# EAGLE schematic MCU board ATmega328p v2.4 (EAGLE 9.2.1)
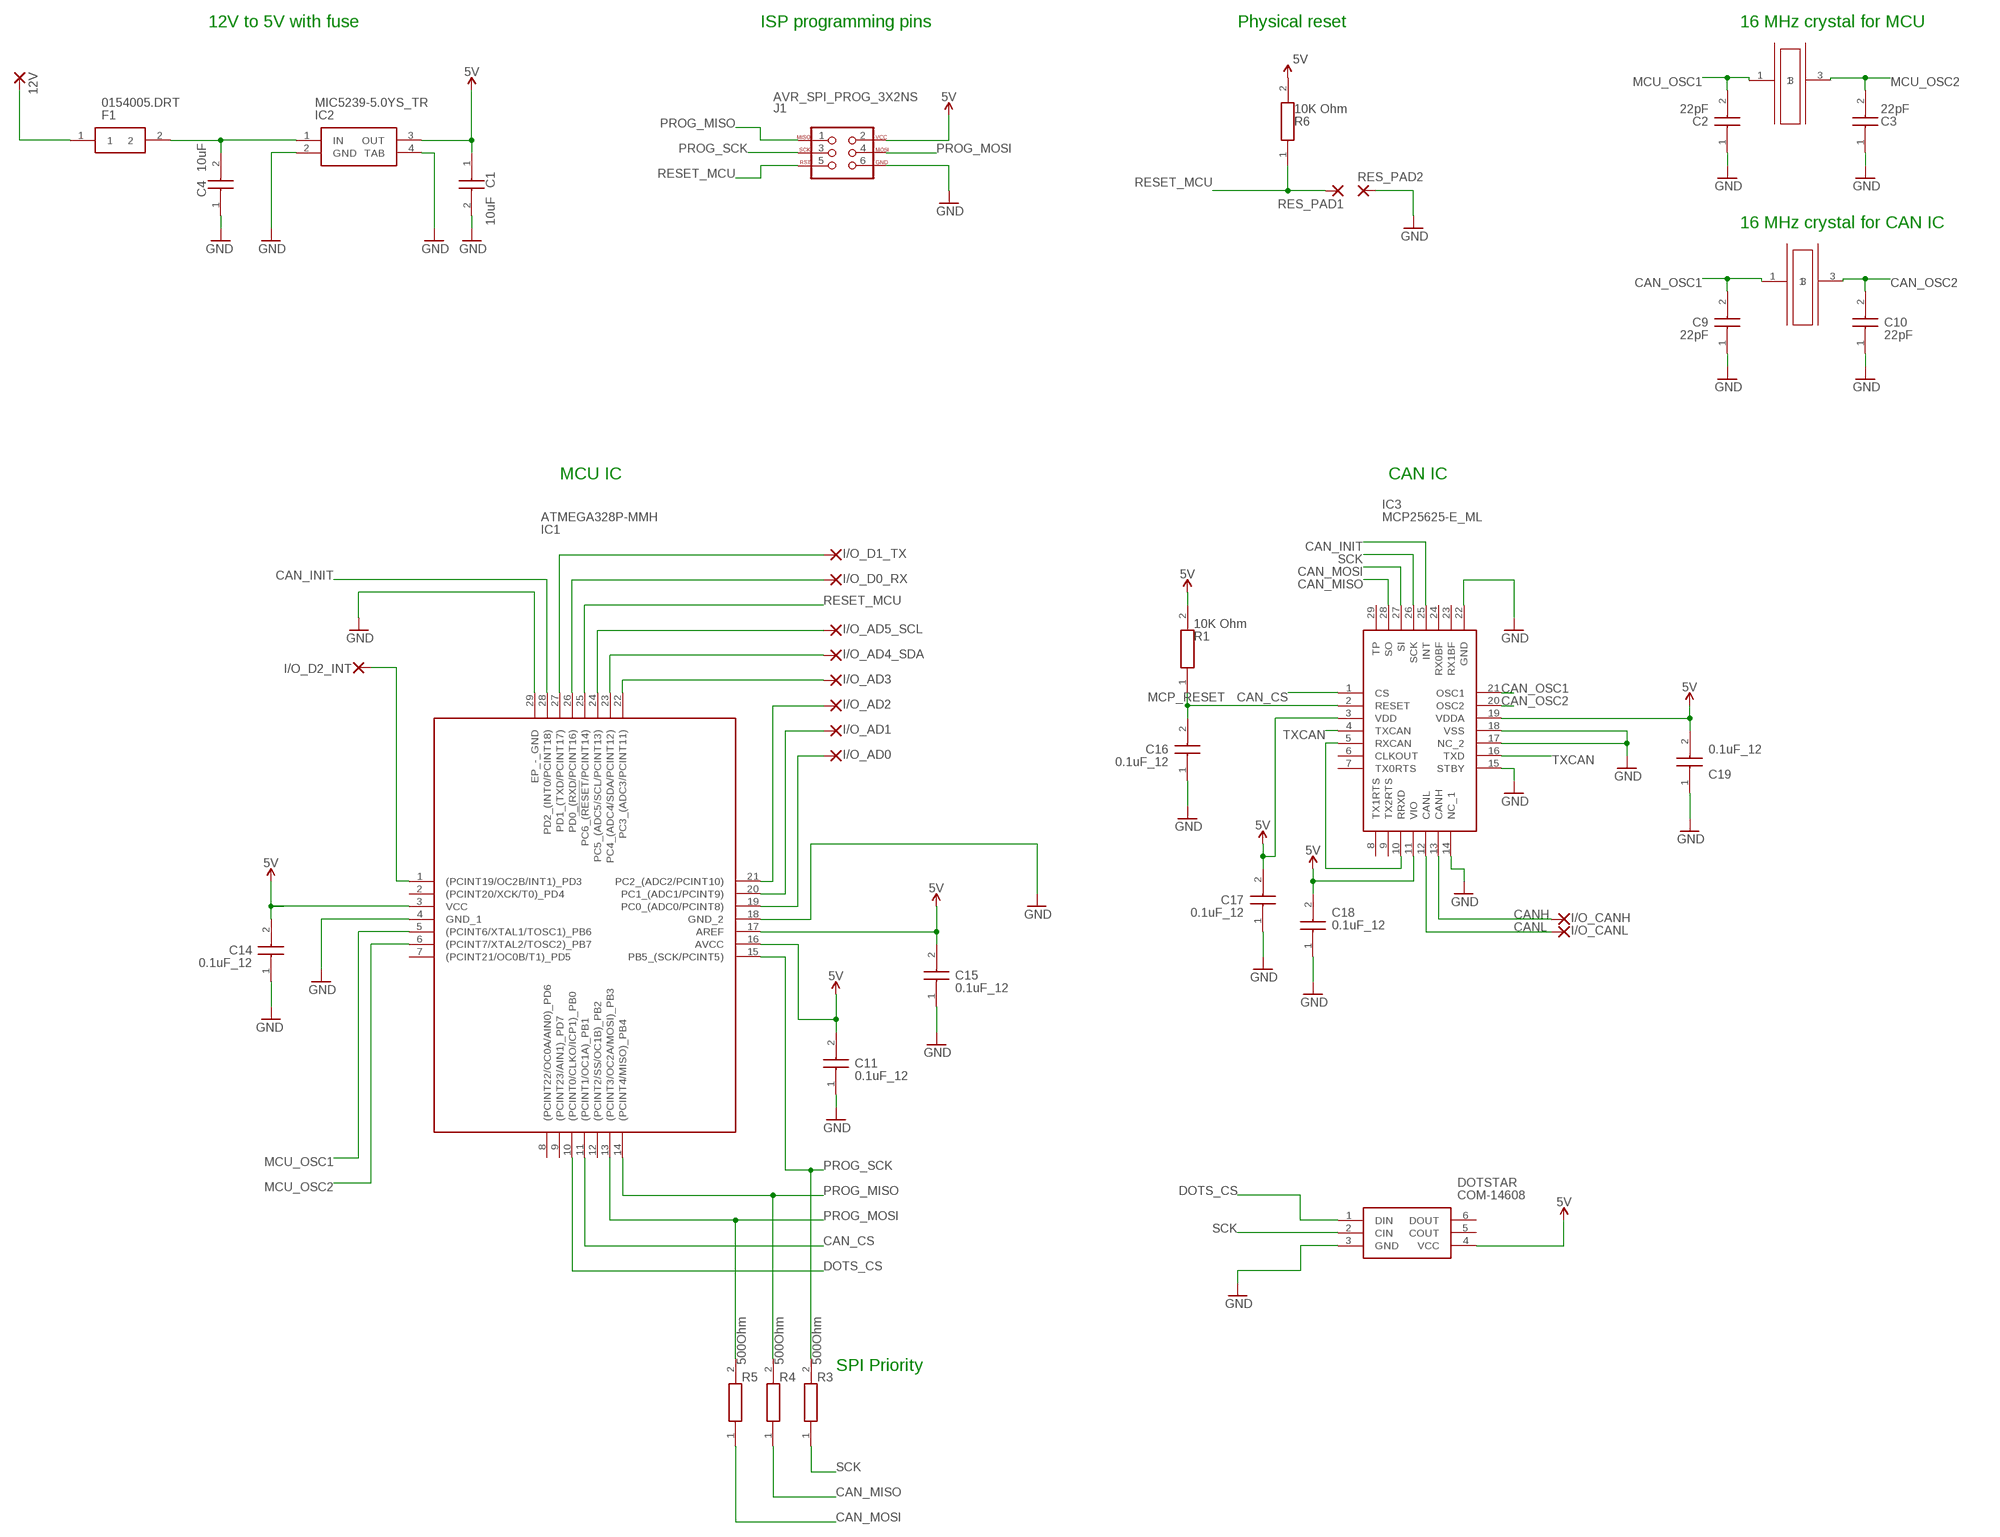
[diagram p0: schematic, sheet 1]

## Parts
12V  2,15/1,0(HALFHOLE)H+V  [2,54/2,0(HALFHOLE)H+V]
C1  10uF  T491A106K016AT  [CAPPM3216X180N]
C2  22pF  12066D106KAT2A  [CAPC3216X229N]
C3  22pF  12066D106KAT2A  [CAPC3216X229N]
C4  10uF  T491A106K016AT  [CAPPM3216X180N]
C9  22pF  12066D106KAT2A  [CAPC3216X229N]
C10  22pF  12066D106KAT2A  [CAPC3216X229N]
C11  0.1uF_12  12066D106KAT2A  [CAPC3216X229N]
C14  0.1uF_12  12066D106KAT2A  [CAPC3216X229N]
C15  0.1uF_12  12066D106KAT2A  [CAPC3216X229N]
C16  0.1uF_12  12066D106KAT2A  [CAPC3216X229N]
C17  0.1uF_12  12066D106KAT2A  [CAPC3216X229N]
C18  0.1uF_12  12066D106KAT2A  [CAPC3216X229N]
C19  0.1uF_12  12066D106KAT2A  [CAPC3216X229N]
DOTSTAR  COM-14608  [SON75P200X200X100-6N]
F1  0154005.DRT  [0154001.DRT]
I/O_AD0  2,15/1,0(HALFHOLE)H+V  [2,54/2,0(HALFHOLE)H+V]
I/O_AD1  2,15/1,0(HALFHOLE)H+V  [2,54/2,0(HALFHOLE)H+V]
I/O_AD2  2,15/1,0(HALFHOLE)H+V  [2,54/2,0(HALFHOLE)H+V]
I/O_AD3  2,15/1,0(HALFHOLE)H+V  [2,54/2,0(HALFHOLE)H+V]
I/O_AD4_SDA  2,15/1,0(HALFHOLE)H+V  [2,54/2,0(HALFHOLE)H+V]
I/O_AD5_SCL  2,15/1,0(HALFHOLE)H+V  [2,54/2,0(HALFHOLE)H+V]
I/O_CANH  2,15/1,0(HALFHOLE)H+V  [2,54/2,0(HALFHOLE)H+V]
I/O_CANL  2,15/1,0(HALFHOLE)H+V  [2,54/2,0(HALFHOLE)H+V]
I/O_D0_RX  2,15/1,0(HALFHOLE)H+V  [2,54/2,0(HALFHOLE)H+V]
I/O_D1_TX  2,15/1,0(HALFHOLE)H+V  [2,54/2,0(HALFHOLE)H+V]
I/O_D2_INT  2,15/1,0(HALFHOLE)H+V  [2,54/2,0(HALFHOLE)H+V]
IC1  ATMEGA328P-MMH  [QFN45P400X400X100-29N]
IC2  MIC5239-5.0YS_TR  [SOT230P700X170-4N]
IC3  MCP25625-E_ML  [QFN65P600X600X100-29N]
J1  AVR_SPI_PROG_3X2NS  [2X3-NS]
R1  10K Ohm  CRCW120610K0FKEAHP  [RESC3116X65N]
R3  500Ohm  CRCW1206499RFKEAHP  [RESC3116X65N]
R4  500Ohm  CRCW1206499RFKEAHP  [RESC3116X65N]
R5  500Ohm  CRCW1206499RFKEAHP  [RESC3116X65N]
R6  10K Ohm  CRCW120610K0FKEAHP  [RESC3116X65N]
RES_PAD1  SMD2  [SMD1,27-2,54]
RES_PAD2  SMD2  [SMD1,27-2,54]
U$1  FA-20H  [FA-20H]
U$2  FA-20H  [FA-20H]

## Nets
5V: C1.1(K) C11.2 C14.2 C15.2 C17.2 C18.2 C19.2 DOTSTAR.4(VCC) IC1.3(VCC) IC1.16(AVCC) IC1.17(AREF) IC2.3(OUT) IC3.3(VDD) IC3.11(VIO) IC3.19(VDDA) J1.2 R1.2 R6.2
12V_FUSED: C4.2(A) F1.2 IC2.1(IN)
12V_UNFUSED: 12V.P$1(P) F1.1
CAN_CS: IC1.11((PCINT1/OC1A)_PB1) IC3.1(CS)
CAN_INIT: IC1.28(PD2_(INT0/PCINT18)) IC3.25(INT)
CAN_MISO: IC3.28(SO) R4.1
CAN_MOSI: IC3.27(SI) R5.1
CAN_OSC1: C9.2 IC3.21(OSC1) U$1.1
CAN_OSC2: C10.2 IC3.20(OSC2) U$1.3
CANH: I/O_CANH.P$1(P) IC3.13(CANH)
CANL: I/O_CANL.P$1(P) IC3.12(CANL)
DOTS_CS: DOTSTAR.1(DIN) IC1.10((PCINT0/CLKO/ICP1)_PB0)
GND: C1.2(A) C2.1 C3.1 C4.1(K) C9.1 C10.1 C11.1 C14.1 C15.1 C16.1 C17.1 C18.1 C19.1 DOTSTAR.3(GND) IC1.4(GND_1) IC1.18(GND_2) IC1.29(EP_-_GND) IC2.2(GND) IC2.4(TAB) IC3.14(NC_1) IC3.15(STBY) IC3.17(NC_2) IC3.18(VSS) IC3.22(GND) J1.6 RES_PAD2.1(P)
I/O_AD0: I/O_AD0.P$1(P) IC1.19(PC0_(ADC0/PCINT8))
I/O_AD1: I/O_AD1.P$1(P) IC1.20(PC1_(ADC1/PCINT9))
I/O_AD2: I/O_AD2.P$1(P) IC1.21(PC2_(ADC2/PCINT10))
I/O_AD3: I/O_AD3.P$1(P) IC1.22(PC3_(ADC3/PCINT11))
I/O_AD4_SCL: I/O_AD4_SDA.P$1(P) IC1.23(PC4_(ADC4/SDA/PCINT12))
I/O_AD5_SCL: I/O_AD5_SCL.P$1(P) IC1.24(PC5_(ADC5/SCL/PCINT13))
I/O_D0_RX: I/O_D0_RX.P$1(P) IC1.26(PD0_(RXD/PCINT16))
I/O_D1_TX: I/O_D1_TX.P$1(P) IC1.27(PD1_(TXD/PCINT17))
I/O_D2_INT: I/O_D2_INT.P$1(P) IC1.1((PCINT19/OC2B/INT1)_PD3)
MCP_RESET: C16.2 IC3.2(RESET) R1.1
MCU_OSC1: C2.2 IC1.5((PCINT6/XTAL1/TOSC1)_PB6) U$2.1
MCU_OSC2: C3.2 IC1.6((PCINT7/XTAL2/TOSC2)_PB7) U$2.3
PROG_MISO: IC1.14((PCINT4/MISO)_PB4) J1.1 R4.2
PROG_MOSI: IC1.13((PCINT3/OC2A/MOSI)_PB3) J1.4 R5.2
PROG_SCK: IC1.15(PB5_(SCK/PCINT5)) J1.3 R3.2
RESET_MCU: IC1.25(PC6_(!RESET!/PCINT14)) J1.5 R6.1 RES_PAD1.1(P)
RXCAN: IC3.5(RXCAN) IC3.10(RRXD)
SCK: DOTSTAR.2(CIN) IC3.26(SCK) R3.1
TXCAN: IC3.4(TXCAN) IC3.16(TXD)
Unconnected: DOTSTAR.5(COUT) DOTSTAR.6(DOUT) IC1.2((PCINT20/XCK/T0)_PD4) IC1.7((PCINT21/OC0B/T1)_PD5) IC1.8((PCINT22/OC0A/AIN0)_PD6) IC1.9((PCINT23/AIN1)_PD7) IC1.12((PCINT2/SS/OC1B)_PB2) IC3.6(CLKOUT) IC3.7(TX0RTS) IC3.8(TX1RTS) IC3.9(TX2RTS) IC3.23(RX1BF) IC3.24(RX0BF) IC3.29(TP)

## Notes on the sheet
- 12V to 5V with fuse | ISP programming pins | Physical reset | 16 MHz crystal for MCU
- 16 MHz crystal for CAN IC
- MCU IC | CAN IC
- SPI Priority

## Library data of the parts
12V I/O_AD0 I/O_AD1-I/O_AD3 I/O_AD4_SDA I/O_AD5_SCL I/O_CANH I/O_CANL I/O_D0_RX I/O_D1_TX I/O_D2_INT = wirepad_edit:2,15/1,0(HALFHOLE)H+V: THROUGH-HOLE PAD
C1 C4 = T491A106K016AT:T491A106K016AT: Capacitor Tantalum T491 Case A 16V 10uF Kemet ????10% 10????F 16 V dc SMD Tantalum Electrolytic Capacitor, A ESR 7???? +125????C T491 Source: Datasheet <http://www.kemet.com/Lists/ProductCatalog/Attachments/254/KEM_T2005_T491.pdf>; ARROW_PART_NUMBER: T491A106K016AT; ARROW_PRICE-STOCK: https://www.arrow.com/en/products/t491a106k016at/kemet-corporation; DESCRIPTION: Capacitor Tantalum T491 Case A 16V 10uF Kemet ????10% 10????F 16 V dc SMD Tantalum Electrolytic Capacitor, A ESR 7???? +125????C T491; HEIGHT: 1.8mm; MANUFACTURER_NAME: Kemet; MANUFACTURER_PART_NUMBER: T491A106K016AT; RS_PART_NUMBER: 1696687; RS_PRICE-STOCK: http://uk.rs-online.com/web/p/products/1696687
C2 C3 C9-C11 C14-C19 = 12066D106KAT2A:12066D106KAT2A: AVX 10uF /-10% 6.3 V dc X5R Dielectric SMD Ceramic Multilayer Capacitor 1206 Source: Datasheet <http://datasheets.avx.com/cx5r.pdf>; ALLIED_NUMBER: 70002294; ALLIED_PRICE-STOCK: http://www.alliedelec.com/avx-12066d106kat2a/70002294/; ARROW_PART_NUMBER: 12066D106KAT2A; ARROW_PRICE-STOCK: http://uk.rs-online.com/web/p/products/1356756; DESCRIPTION: AVX 10uF /-10% 6.3 V dc X5R Dielectric SMD Ceramic Multilayer Capacitor 1206; HEIGHT: 2.29mm; MANUFACTURER_NAME: AVX; MANUFACTURER_PART_NUMBER: 12066D106KAT2A; RS_PART_NUMBER: 1356756; RS_PRICE-STOCK: http://uk.rs-online.com/web/p/products/1356756
DOTSTAR = APA102–2020:COM-14608: SparkFun Accessories SMD LED - RGB APA102-2020 Source: Datasheet <https://componentsearchengine.com/Datasheets/1/COM-14608.pdf>; ARROW_PART_NUMBER: COM-14608; DESCRIPTION: SparkFun Accessories SMD LED - RGB APA102-2020; HEIGHT: 1mm; MANUFACTURER_NAME: SparkFun; MANUFACTURER_PART_NUMBER: COM-14608
F1 = 0154005(Fuseholder)DRT:0154005.DRT: Littelfuse 5A T Surface Mount Fuse, 125V ac/dc Source: Datasheet <http://www.littelfuse.com/~/media/electronics/datasheets/fuses/littelfuse_fuse_154_154t_154l_154tl_datasheet.pdf.pdf>; ALLIED_NUMBER: 70184875; ALLIED_PRICE-STOCK: https://www.alliedelec.com/littelfuse-0154005-drt/70184875/; ARROW_PART_NUMBER: 0154005.DRT; ARROW_PRICE-STOCK: https://www.arrow.com/en/products/0154005.drt/littelfuse; DESCRIPTION: Littelfuse 5A T Surface Mount Fuse, 125V ac/dc; HEIGHT: mm; MANUFACTURER_NAME: LITTELFUSE; MANUFACTURER_PART_NUMBER: 0154005.DRT; RS_PART_NUMBER: 2196260P; RS_PRICE-STOCK: http://uk.rs-online.com/web/p/products/2196260P
IC1 = ATMEGA328P-MMH:ATMEGA328P-MMH: Atmel ATMEGA328P-MMH, 8bit AVR Microcontroller, 20MHz, 32 kB Flash, 28-Pin QFN Source: Datasheet <http://uk.rs-online.com/web/p/products/8149138P>; ARROW_PART_NUMBER: ATMEGA328P-MMH; ARROW_PRICE-STOCK: https://www.arrow.com/en/products/atmega328p-mmh/microchip-technology; DESCRIPTION: Atmel ATMEGA328P-MMH, 8bit AVR Microcontroller, 20MHz, 32 kB Flash, 28-Pin QFN; HEIGHT: 1mm; MANUFACTURER_NAME: Microchip; MANUFACTURER_PART_NUMBER: ATMEGA328P-MMH; RS_PART_NUMBER: 1310272P; RS_PRICE-STOCK: http://uk.rs-online.com/web/p/products/1310272P
IC2 = MIC5239-5.0YS_TR:MIC5239-5.0YS_TR: LDO Regulator Pos 5V 0.5A Micrel MIC5239-5.0YS TR, LDO Voltage Regulator, 500mA, 5 V 1%, 2.3 30 Vin, 3 + Tab-Pin SOT-223 Source: Datasheet <http://ww1.microchip.com/downloads/en/DeviceDoc/mic5239.pdf>; ARROW_PART_NUMBER: MIC5239-5.0YS TR; ARROW_PRICE-STOCK: http://uk.rs-online.com/web/p/products/7275535P; DESCRIPTION: LDO Regulator Pos 5V 0.5A Micrel MIC5239-5.0YS TR, LDO Voltage Regulator, 500mA, 5 V 1%, 2.3 30 Vin, 3 + Tab-Pin SOT-223; HEIGHT: 1.7mm; MANUFACTURER_NAME: Micrel; MANUFACTURER_PART_NUMBER: MIC5239-5.0YS TR; RS_PART_NUMBER: 7275535P; RS_PRICE-STOCK: http://uk.rs-online.com/web/p/products/7275535P
IC3 = MCP25625-E_ML:MCP25625-E_ML: CAN Controller with Transceiver QFN28 Microchip MCP25625-E/ML, CAN Controller, 28-Pin QFN Source: Datasheet <http://docs-europe.electrocomponents.com/webdocs/137c/0900766b8137cddf.pdf>; ALLIED_NUMBER: 70431541; ALLIED_PRICE-STOCK: http://www.alliedelec.com/microchip-technology-inc-mcp25625-e-ml/70431541/; ARROW_PART_NUMBER: MCP25625-E/ML; ARROW_PRICE-STOCK: https://www.arrow.com/en/products/mcp25625-eml/microchip-technology; DESCRIPTION: CAN Controller with Transceiver QFN28 Microchip MCP25625-E/ML, CAN Controller, 28-Pin QFN; HEIGHT: 1mm; MANUFACTURER_NAME: Microchip; MANUFACTURER_PART_NUMBER: MCP25625-E/ML; RS_PART_NUMBER: 1654104; RS_PRICE-STOCK: http://uk.rs-online.com/web/p/products/1654104
J1 = SparkFun-Connectors:AVR_SPI_PROG_3X2: AVR ISP 6 Pin This is the reduced ISP connector for AVR programming. Common on Arduino. This footprint will take up less PCB space and can be used with a 10-pin to 6-pin adapter such as SKU: BOB-08508 **Special note about "TEST_POINT" package. The stop mask is on the top side, so if you want your programming test points to be on the bottom of your board, make sure to place this package on the bottom side of the board. This also ensure that the orientation to program from the bottom side will be correct. SparkFun Products: SparkFun ISP Pogo Adapter <https://www.sparkfun.com/products/11591> - NS Tiny AVR Programmer <https://www.sparkfun.com/products/11801> -PTH
R1 R6 = CRCW120610K0FKEAHP(10K Ohm):CRCW120610K0FKEAHP: Thick Film Resistors - SMD 1/2watt 10Kohms 1% 100ppm High Power Source: Datasheet <http://componentsearchengine.com/Datasheets/1/CRCW120610K0FKEAHP.pdf>; ALLIED_NUMBER: 70615931; ALLIED_PRICE-STOCK: https://www.alliedelec.com/vishay-dale-crcw120610k0fkeahp/70615931/; ARROW_PART_NUMBER: CRCW120610K0FKEAHP; ARROW_PRICE-STOCK: https://www.arrow.com/en/products/crcw120610k0fkeahp/vishay; DESCRIPTION: Thick Film Resistors - SMD 1/2watt 10Kohms 1% 100ppm High Power; HEIGHT: 0.65mm; MANUFACTURER_NAME: Vishay; MANUFACTURER_PART_NUMBER: CRCW120610K0FKEAHP; RS_PART_NUMBER: 8121789P; RS_PRICE-STOCK: http://uk.rs-online.com/web/p/products/8121789P
R3-R5 = CRCW1206499RFKEAHP(499ohm resistor):CRCW1206499RFKEAHP: Standard Thick Film Chip Resistors value VALUE1 ohm. Source: Datasheet; ARROW_PART_NUMBER: CRCW1206499RFKEAHP; ARROW_PRICE-STOCK: https://www.arrow.com/en/products/crcw1206499rfkeahp/vishay; DESCRIPTION: Standard Thick Film Chip Resistors value VALUE1 ohm.; HEIGHT: 0.65mm; MANUFACTURER_NAME: Vishay; MANUFACTURER_PART_NUMBER: CRCW1206499RFKEAHP
RES_PAD1 RES_PAD2 = wirepad:SMD2: SMD PAD
U$1 U$2 = FA-20H 16.0000MF20X-B:FA-20H